# Altium schematic sheet 1_CORE.schdoc.schdoc
size 431 x 309 mm; Symbol: Sheet-Symbol_A3; Device: Sheet-Symbol_A3; Company: 嘉立创EDA; Version: V1.0; Page Size: A3; @Project Name: V3S_LCD; @Page Count: 4; @Update Date: 2023-12-17; @Create Date: 2023-12-14; @Schematic Name: Schematic1; @Page No: 1; @Page Name: CORE
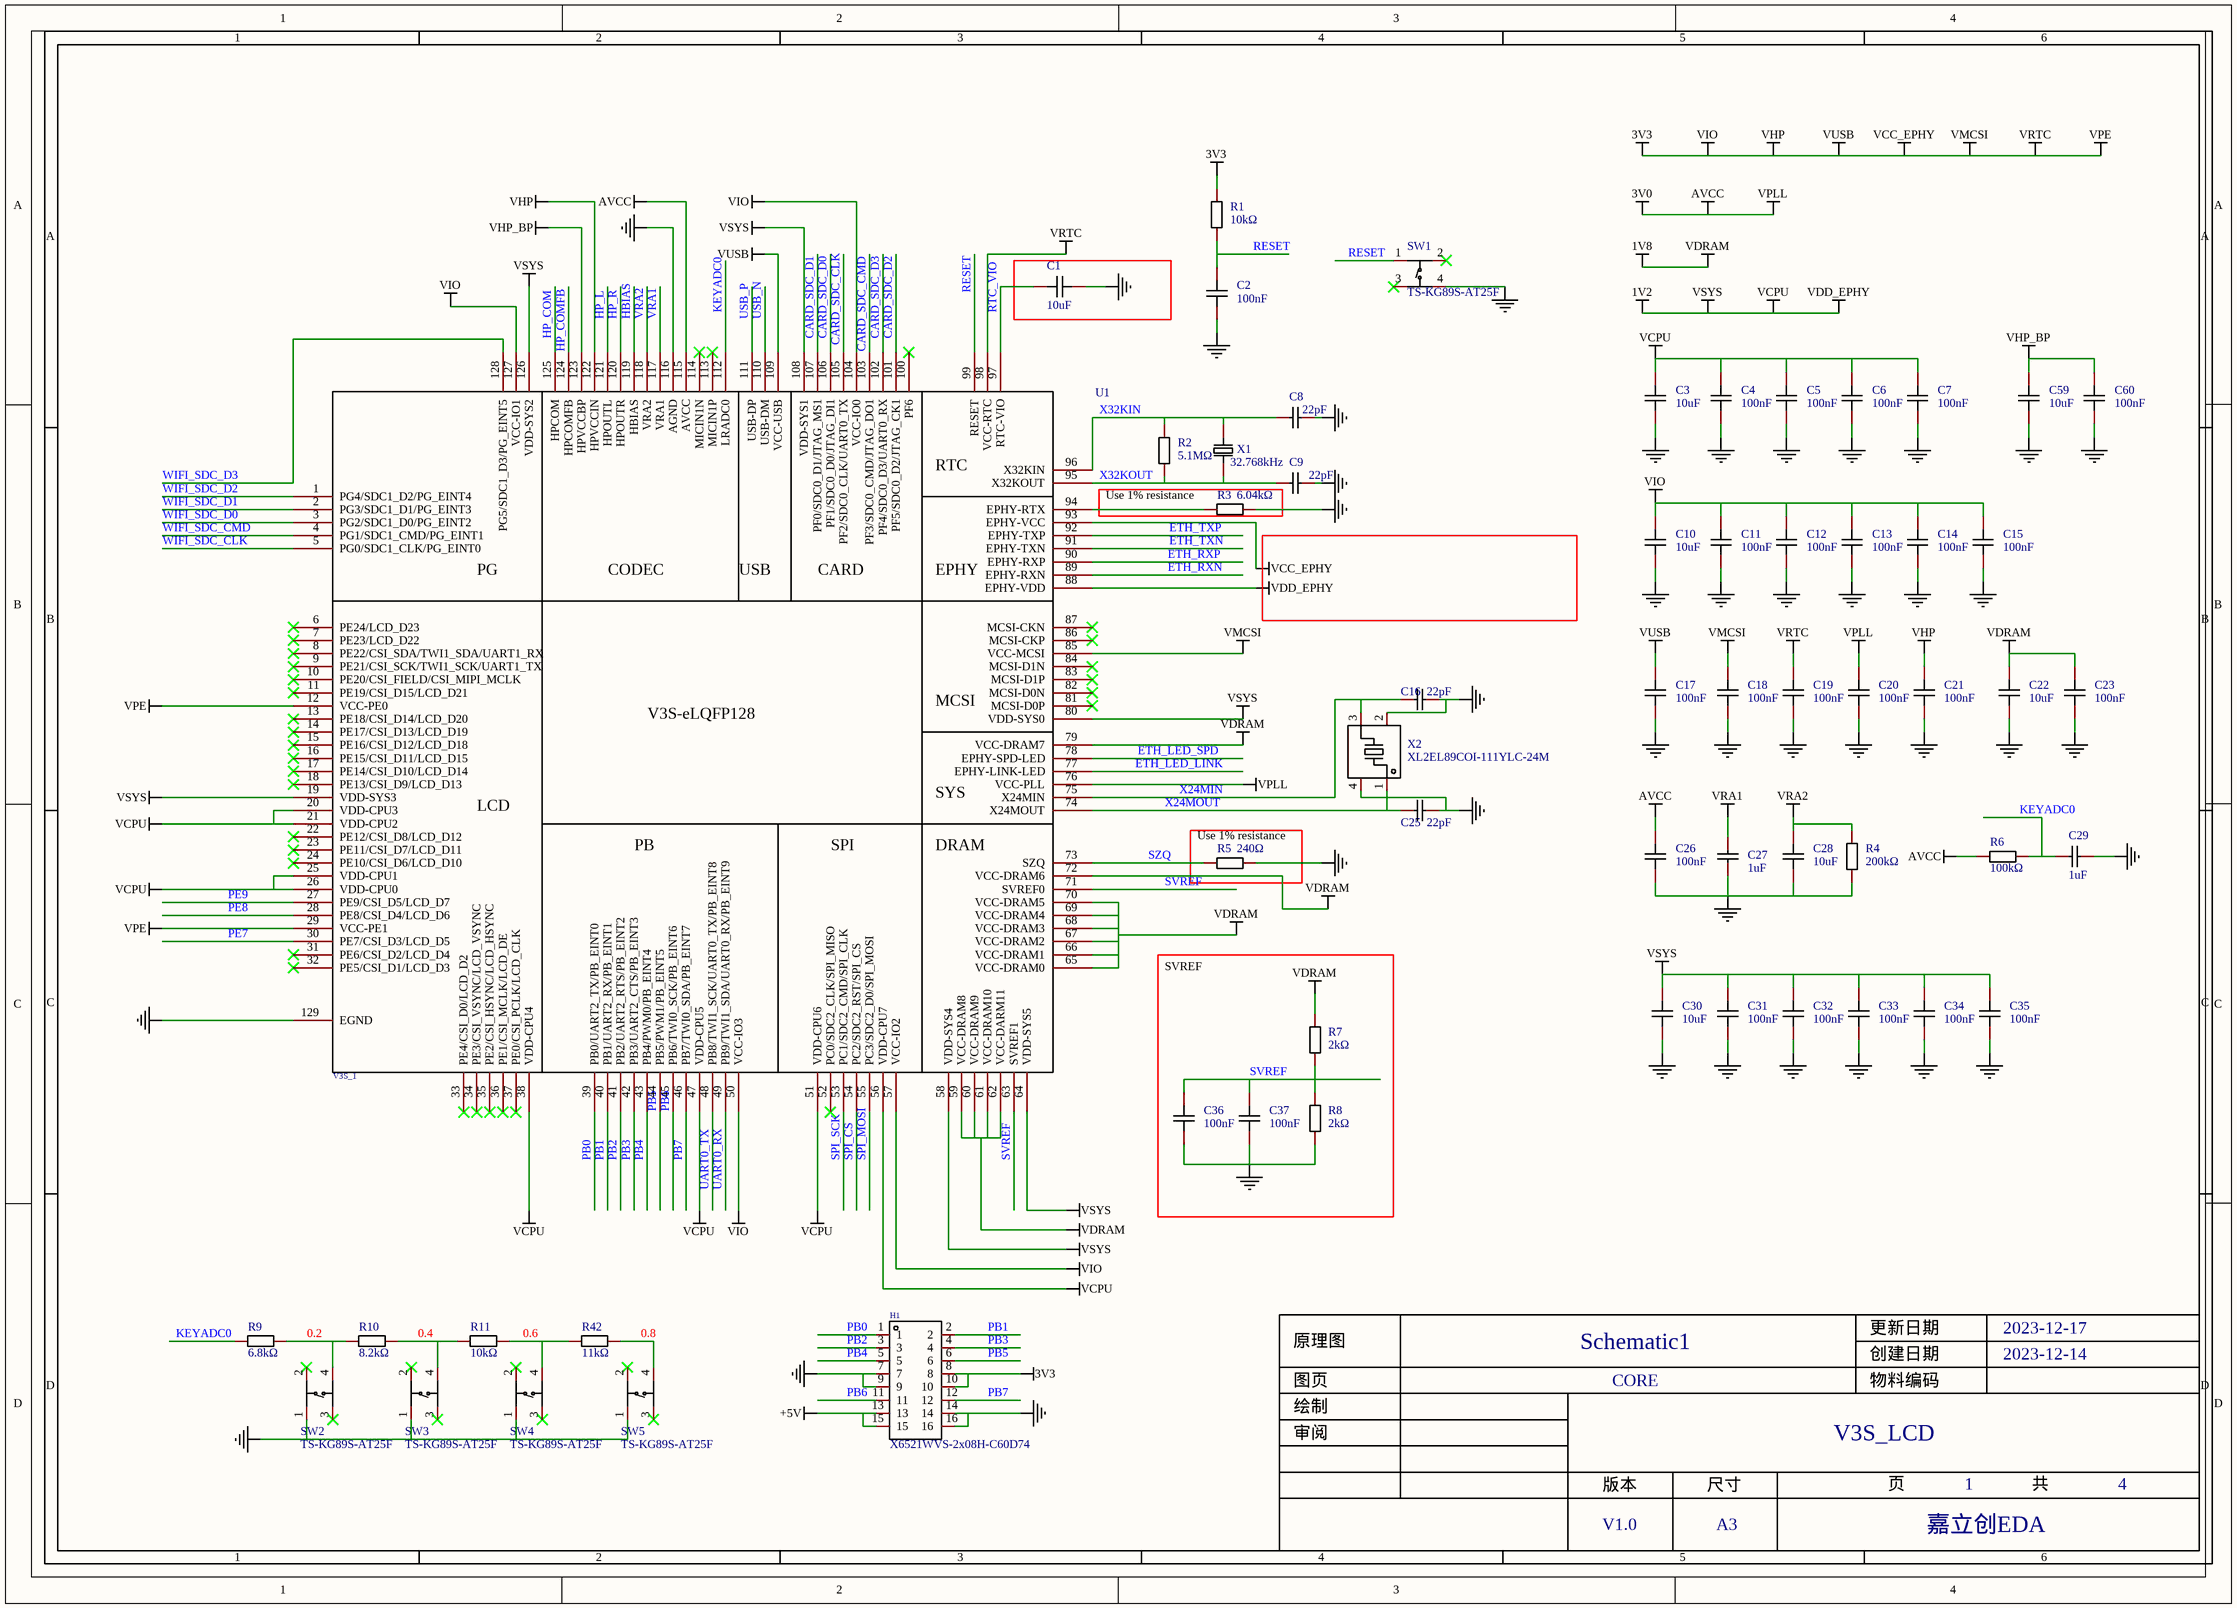
[diagram p0: 1_CORE.schdoc.schdoc]

## Parts
C1  10uF  [C0603]
C2  100nF  [C0603]
C3  10uF  [C0603]
C4  100nF  [C0603]
C5  100nF  [C0603]
C6  100nF  [C0603]
C7  100nF  [C0603]
C8  22pF  [C0603]
C9  22pF  [C0603]
C10  10uF  [C0603]
C11  100nF  [C0603]
C12  100nF  [C0603]
C13  100nF  [C0603]
C14  100nF  [C0603]
C15  100nF  [C0603]
C16  22pF  [C0603]
C17  100nF  [C0603]
C18  100nF  [C0603]
C19  100nF  [C0603]
C20  100nF  [C0603]
C21  100nF  [C0603]
C22  10uF  [C0603]
C23  100nF  [C0603]
C25  22pF  [C0603]
C26  100nF  [C0603]
C27  1uF  [C0603]
C28  10uF  [C0603]
C29  1uF  [C0603]
C30  10uF  [C0603]
C31  100nF  [C0603]
C32  100nF  [C0603]
C33  100nF  [C0603]
C34  100nF  [C0603]
C35  100nF  [C0603]
C36  100nF  [C0603]
C37  100nF  [C0603]
C59  10uF  [C0603]
C60  100nF  [C0603]
H1  X6521WVS-2x08H-C60D74  [HDR-SMD_16P-P2.54-V-M-R2-C8-S7.4]
R1  10kΩ  [R0603]
R2  5.1MΩ  [R0603]
R3  6.04kΩ  [R0603]
R4  200kΩ  [R0603]
R5  240Ω  [R0603]
R6  100kΩ  [R0603]
R7  2kΩ  [R0603]
R8  2kΩ  [R0603]
R9  6.8kΩ  [R0603]
R10  8.2kΩ  [R0603]
R11  10kΩ  [R0603]
R42  11kΩ  [R0603]
SW1  TS-KG89S-AT25F  [SW-SMD_4P-L4.2-W3.3-P2.15-LS5.1]
SW2  TS-KG89S-AT25F  [SW-SMD_4P-L4.2-W3.3-P2.15-LS5.1]
SW3  TS-KG89S-AT25F  [SW-SMD_4P-L4.2-W3.3-P2.15-LS5.1]
SW4  TS-KG89S-AT25F  [SW-SMD_4P-L4.2-W3.3-P2.15-LS5.1]
SW5  TS-KG89S-AT25F  [SW-SMD_4P-L4.2-W3.3-P2.15-LS5.1]
U1  V3S_1  [LQFP129 14x14_N]
X1  32.768kHz  [FC-135R_L3.2-W1.5]
X2  XL2EL89COI-111YLC-24M  [CRYSTAL-SMD_4P-L3.2-W2.5-BL]

## Blocks framed on the sheet
Use 1% resistance: R3
Use 1% resistance: R5
SVREF: C36 C37 R7 R8

## Nets
1V2: C3.2 C4.2 C5.2 C6.2 C7.2 C30.2 C31.2 C32.2 C33.2 C34.2 C35.2 U1.19(VDD-SYS3) U1.20(VDD-CPU3) U1.21(VDD-CPU2) U1.25(VDD-CPU1) U1.26(VDD-CPU0) U1.38(VDD-CPU4) U1.47(VDD-CPU5) U1.51(VDD-CPU6) U1.56(VDD-CPU7) U1.58(VDD-SYS4) U1.64(VDD-SYS5) U1.80(VDD-SYS0) U1.88(EPHY-VDD) U1.108(VDD-SYS1) U1.126(VDD-SYS2)  [also labelled VCPU, VDD_EPHY, VSYS]
1V8: C22.2 C23.2 R7.2 U1.59(VCC-DRAM8) U1.60(VCC-DRAM9) U1.61(VCC-DRAM10) U1.62(VCC-DARM11) U1.65(VCC-DRAM0) U1.66(VCC-DRAM1) U1.67(VCC-DRAM2) U1.68(VCC-DRAM3) U1.69(VCC-DRAM4) U1.70(VCC-DRAM5) U1.72(VCC-DRAM6) U1.79(VCC-DRAM7)  [also labelled VDRAM]
3V0: C20.2 C26.2 R6.1 U1.76(VCC-PLL) U1.115(AVCC)  [also labelled AVCC, VPLL]
3V3: C10.2 C11.2 C12.2 C13.2 C14.2 C15.2 C17.2 C18.2 C19.2 C21.2 H1.8 H1.10 R1.2 U1.12(VCC-PE0) U1.29(VCC-PE1) U1.50(VCC-IO3) U1.57(VCC-IO2) U1.85(VCC-MCSI) U1.93(EPHY-VCC) U1.98(VCC-RTC) U1.104(VCC-IO0) U1.109(VCC-USB) U1.122(HPVCCIN) U1.127(VCC-IO1)  [also labelled VCC_EPHY, VHP, VIO, VMCSI, VPE, VRTC, VUSB]
+5V: H1.13 H1.15
NetC1_2: C1.2 C2.1 C3.1 C4.1 C5.1 C6.1 C7.1 C8.1 C9.1 C10.1 C11.1 C12.1 C13.1 C14.1 C15.1 C16.2 C17.1 C18.1 C19.1 C20.1 C21.1 C22.1 C23.1 C25.2 C26.1 C27.1 C28.1 C29.2 C30.1 C31.1 C32.1 C33.1 C34.1 C35.1 C36.1 C37.1 C59.1 C60.1 H1.7 H1.9 H1.14 H1.16 R3.2 R4.1 R5.2 R8.1 SW1.4 SW2.1 SW3.1 SW4.1 SW5.1 U1.116(AGND) U1.129(EGND) X2.2(GND) X2.4(GND)
VHP_BP: C59.2 C60.2 U1.123(HPVCCBP)
VRA1: C27.2 U1.117(VRA1)
VRA2: C28.2 R4.2 U1.118(VRA2)
CARD_SDC_CLK: U1.105(PF2/SDC0_CLK/UART0_TX)
CARD_SDC_CMD: U1.103(PF3/SDC0_CMD/JTAG_DO1)
CARD_SDC_D0: U1.106(PF1/SDC0_D0/JTAG_DI1)
CARD_SDC_D1: U1.107(PF0/SDC0_D1/JTAG_MS1)
CARD_SDC_D2: U1.101(PF5/SDC0_D2/JTAG_CK1)
CARD_SDC_D3: U1.102(PF4/SDC0_D3/UART0_RX)
ETH_LED_LINK: U1.77(EPHY-LINK-LED)
ETH_LED_SPD: U1.78(EPHY-SPD-LED)
ETH_RXN: U1.89(EPHY-RXN)
ETH_RXP: U1.90(EPHY-RXP)
ETH_TXN: U1.91(EPHY-TXN)
ETH_TXP: U1.92(EPHY-TXP)
HBIAS: U1.119(HBIAS)
HP_COM: U1.125(HPCOM)
HP_COMFB: U1.124(HPCOMFB)
HP_L: U1.121(HPOUTL)
HP_R: U1.120(HPOUTR)
KEYADC0: C29.1 R6.2 R9.1 U1.112(LRADC0)
PB0: H1.1 U1.39(PB0/UART2_TX/PB_EINT0)
PB1: H1.2 U1.40(PB1/UART2_RX/PB_EINT1)
PB2: H1.3 U1.41(PB2/UART2_RTS/PB_EINT2)
PB3: H1.4 U1.42(PB3/UART2_CTS/PB_EINT3)
PB4: H1.5 U1.43(PB4/PWM0/PB_EINT4)
PB5: H1.6 U1.44(PB5/PWM1/PB_EINT5)
PB6: H1.11 U1.45(PB6/TWI0_SCK/PB_EINT6)
PB7: H1.12 U1.46(PB7/TWI0_SDA/PB_EINT7)
PE7: U1.30(PE7/CSI_D3/LCD_D5)
PE8: U1.28(PE8/CSI_D4/LCD_D6)
PE9: U1.27(PE9/CSI_D5/LCD_D7)
RESET: C2.2 R1.1 SW1.1 U1.99(RESET)
RTC_VIO: C1.1 U1.97(RTC-VIO)
SPI_CS: U1.54(PC2/SDC2_RST/SPI_CS)
SPI_MOSI: U1.55(PC3/SDC2_D0/SPI_MOSI)
SPI_SCK: U1.53(PC1/SDC2_CMD/SPI_CLK)
SVREF: C36.2 C37.2 R7.1 R8.2 U1.63(SVREF1) U1.71(SVREF0)
SZQ: R5.1 U1.73(SZQ)
UART0_RX: U1.49(PB9/TWI1_SDA/UART0_RX/PB_EINT9)
UART0_TX: U1.48(PB8/TWI1_SCK/UART0_TX/PB_EINT8)
USB_N: U1.110(USB-DM)
USB_P: U1.111(USB-DP)
WIFI_SDC_CLK: U1.5(PG0/SDC1_CLK/PG_EINT0)
WIFI_SDC_CMD: U1.4(PG1/SDC1_CMD/PG_EINT1)
WIFI_SDC_D0: U1.3(PG2/SDC1_D0/PG_EINT2)
WIFI_SDC_D1: U1.2(PG3/SDC1_D1/PG_EINT3)
WIFI_SDC_D2: U1.1(PG4/SDC1_D2/PG_EINT4)
WIFI_SDC_D3: U1.128(PG5/SDC1_D3/PG_EINT5)
X24MIN: C16.1 U1.75(X24MIN) X2.3
X24MOUT: C25.1 U1.74(X24MOUT) X2.1
X32KIN: C8.2 R2.2 U1.96(X32KIN) X1.2
X32KOUT: C9.2 R2.1 U1.95(X32KOUT) X1.1
NetR3_1: R3.1 U1.94(EPHY-RTX)
NetR9_2: R9.2 R10.1 SW2.4
NetR10_2: R10.2 R11.1 SW3.4
NetR11_2: R11.2 R42.1 SW4.4
NetR42_2: R42.2 SW5.4

Not connected (* = marked no-connect by the designer): SW1 2* 3*; SW2 2* 3*; SW3 2* 3*; SW4 2* 3*; SW5 2* 3*; U1 6(PE24/LCD_D23)* 7(PE23/LCD_D22)* 8(PE22/CSI_SDA/TWI1_SDA/UART1_RX)* 9(PE21/CSI_SCK/TWI1_SCK/UART1_TX)* 10(PE20/CSI_FIELD/CSI_MIPI_MCLK)* 11(PE19/CSI_D15/LCD_D21)* 13(PE18/CSI_D14/LCD_D20)* 14(PE17/CSI_D13/LCD_D19)* 15(PE16/CSI_D12/LCD_D18)* 16(PE15/CSI_D11/LCD_D15)* 17(PE14/CSI_D10/LCD_D14)* 18(PE13/CSI_D9/LCD_D13)* 22(PE12/CSI_D8/LCD_D12)* 23(PE11/CSI_D7/LCD_D11)* 24(PE10/CSI_D6/LCD_D10)* 31(PE6/CSI_D2/LCD_D4)* 32(PE5/CSI_D1/LCD_D3)* 33(PE4/CSI_D0/LCD_D2)* 34(PE3/CSI_VSYNC/LCD_VSYNC)* 35(PE2/CSI_HSYNC/LCD_HSYNC)* 36(PE1/CSI_MCLK/LCD_DE)* 37(PE0/CSI_PCLK/LCD_CLK)* 52(PC0/SDC2_CLK/SPI_MISO)* 81(MCSI-D0P)* 82(MCSI-D0N)* 83(MCSI-D1P)* 84(MCSI-D1N)* 86(MCSI-CKP)* 87(MCSI-CKN)* 100(PF6)* 113(MICIN1P)* 114(MICIN1N)*

## Notes on the sheet
- 0.2
- 0.4
- 0.6
- 0.8
- 1
- 2
- 3
- 4
- 5
- 6
- A
- B
- C
- 原理图
- Schematic1
- 创建日期
- 更新日期
- 2023-12-17
- 2023-12-14
- D
- 审阅
- 绘制
- 图页
- CORE
- 物料编码
- V3S_LCD
- 版本
- 尺寸
- 页
- 共
- V1.0
- A3
- 嘉立创EDA
- (in symbol LQFP129 14x14_N) RTC; PG; CODEC; USB; CARD; EPHY; MCSI; V3S-eLQFP128; SYS; LCD; PB; SPI; DRAM

## Library data of the parts
C1 C3 C10 C22 C28 C30 C59 = CL10A106KP8NNNC: Manufacturer: SAMSUNG(三星); Add into BOM: yes; Tolerance: ±10%; Voltage Rated: 10V; Temperature Coefficient: X5R; Description: 容值:10uF;精度:±10%;额定电压:10V;材质(温度系数):X5R;; Name: 10uF; Symbol: CL10A106KP8NNNC; Device: CL10A106KP8NNNC; Supplier: LCSC; Manufacturer Part: CL10A106KP8NNNC; Value: 10uF; Supplier Part: C19702; JLCPCB Part Class: 基础库; LCSC Part Name: 10uF ±10% 10V; Supplier Footprint: 0603; Datasheet: https://atta.szlcsc.com/upload/public/pdf/source/20160218/1457707763339.pdf; Convert to PCB: yes
C2 C4-C7 C11-C15 C17-C21 C23 C26 C31-C37 C60 = CC0603KRX7R9BB104: Manufacturer: YAGEO(国巨); Add into BOM: yes; Tolerance: ±10%; Voltage Rated: 50V; Temperature Coefficient: X7R; Description: 容值:100nF;精度:±10%;额定电压:50V;材质(温度系数):X7R;; Name: 100nF; Symbol: CC0603KRX7R9BB104; Device: CC0603KRX7R9BB104; Supplier: LCSC; Manufacturer Part: CC0603KRX7R9BB104; Value: 100nF; Supplier Part: C14663; JLCPCB Part Class: Basic Part; LCSC Part Name: 100nF ±10% 50V; Supplier Footprint: 0603; Datasheet: https://atta.szlcsc.com/upload/public/pdf/source/20180910/C282072_33301C7F631E79921B82A8DAC6BCC5B3.pdf; Convert to PCB: yes
C8 C9 C16 C25 = CL10C220JB8NNNC: Manufacturer: SAMSUNG(三星); Add into BOM: yes; Tolerance: ±5%; Voltage Rated: 50V; Temperature Coefficient: C0G; Description: 容值:22pF;精度:±5%;额定电压:50V;材质(温度系数):C0G;; Name: 22pF; Symbol: CL10C220JB8NNNC; Device: CL10C220JB8NNNC; Supplier: LCSC; Manufacturer Part: CL10C220JB8NNNC; Value: 22pF; Supplier Part: C1653; LCSC Part Name: 22pF ±5% 50V; Supplier Footprint: 0603; Datasheet: https://atta.szlcsc.com/upload/public/pdf/source/20160218/1457707763339.pdf; Convert to PCB: yes
  C8 C9: JLCPCB Part Class: 基础库
  C16 C25: JLCPCB Part Class: Basic Part
C27 C29 = CL10A105KB8NNNC: Manufacturer: SAMSUNG(三星); Add into BOM: yes; Tolerance: ±10%; Voltage Rated: 50V; Temperature Coefficient: X5R; Description: 容值:1uF;精度:±10%;额定电压:50V;材质(温度系数):X5R;; Name: 1uF; Symbol: CL10A105KB8NNNC; Device: CL10A105KB8NNNC; Supplier: LCSC; Manufacturer Part: CL10A105KB8NNNC; Value: 1uF; Supplier Part: C15849; JLCPCB Part Class: Basic Part; LCSC Part Name: 1uF ±10% 50V; Supplier Footprint: 0603; Datasheet: https://atta.szlcsc.com/upload/public/pdf/source/20160218/1457707763339.pdf; Convert to PCB: yes
H1 = X6521WVS-2x08H-C60D74: Manufacturer: XKB Connectivity(中国星坤); Add into BOM: yes; Pitch: 2.54mm; Pin Structure: 2x8P; Circluar Pins/Square Pins: 方针; Current Rating (Max): 3A; Voltage Rating (Max): 250V; Welding Temperature (Max): 260℃; Description: 间距:2.54mm;总PIN位数:16;排数:2;插针结构:2x8P;行距:-;安装类型:立贴;圆针/方针:方针;额定电流:3A;额定电压:250V;配合针长度:6mm;塑高:2.5mm;端接针长度:-;触头材质:黄铜;触头镀层:金;工作温度范围:-40℃~+105℃;焊接温度(最大值):260℃;; Name: X6521WVS-2x08H-C60D74; Symbol: X6521WVS-2X08H-C60D74; Device: X6521WVS-2x08H-C60D74; Supplier: LCSC; Supplier Part: C2884017; Manufacturer Part: X6521WVS-2x08H-C60D74; link: https://atta.szlcsc.com/upload/public/pdf/source/20211009/E3239EE5247E6BAFECB8B74A4FCF9AB8.pdf; JLCPCB Part Class: 扩展库; LCSC Part Name: 2.54mm 2x8P; Supplier Footprint: SMD,P=2.54mm; Convert to PCB: yes; Number of Pins: 16; Number of Rows: 2; Row Spacing: -; Mounting Type: 立贴; Length of Mating Pin: 6mm; Insulation Height: 2.5mm; Length of End Connection Pin: -; Contact Material: 黄铜; Contact Plating: 金; Operating Temperature Range: -40℃~+105℃
R1 R11 = 0603WAF1002T5E: Manufacturer: UNI-ROYAL(厚声); Add into BOM: yes; Tolerance: ±1%; Power(Watts): 100mW; Overload Voltage (Max): 75V; Temperature Coefficient: ±100ppm/℃; Description: 阻值:10kΩ;精度:±1%;功率:100mW;温度系数:±100ppm/℃;电阻类型:厚膜电阻;; Name: 10kΩ; Symbol: 0603WAF1002T5E; Device: 0603WAF1002T5E; Supplier: LCSC; Manufacturer Part: 0603WAF1002T5E; Supplier Part: C25804; Value: 10kΩ; JLCPCB Part Class: Basic Part; LCSC Part Name: 10kΩ ±1% 100mW 厚膜电阻; Supplier Footprint: 0603; Datasheet: https://atta.szlcsc.com/upload/public/pdf/source/20200306/C422600_1E6D84923E4A46A82E41ADD87F860B5C.pdf; Convert to PCB: yes; Type: 厚膜电阻; Operating Temperature Range: -55℃~+155℃
R2 = 0603WAF5104T5E: Manufacturer: UNI-ROYAL(厚声); Add into BOM: yes; Tolerance: ±1%; Power(Watts): 100mW; Overload Voltage (Max): 75V; Temperature Coefficient: ±100ppm/℃; Description: 阻值:5.1MΩ;精度:±1%;功率:100mW;温度系数:±100ppm/℃;电阻类型:厚膜电阻;; Name: 5.1MΩ; Symbol: 0603WAF5104T5E; Device: 0603WAF5104T5E; Supplier: LCSC; Manufacturer Part: 0603WAF5104T5E; Supplier Part: C13320; Value: 5.1MΩ; JLCPCB Part Class: 扩展库; LCSC Part Name: 5.1MΩ ±1% 100mW 厚膜电阻; Supplier Footprint: 0603; Datasheet: https://atta.szlcsc.com/upload/public/pdf/source/20200306/C422600_1E6D84923E4A46A82E41ADD87F860B5C.pdf; Convert to PCB: yes; Type: 厚膜电阻; Operating Temperature Range: -55℃~+155℃
R3 = RS-03K6041FT: Manufacturer: FH(风华); Add into BOM: yes; Tolerance: ±1%; Temperature Coefficient: ±100ppm/℃; Power(Watts): 100mW; Overload Voltage (Max): 50V; Description: 精度:±1%;阻值:6.04kΩ;温度系数:±100ppm/℃;功率:100mW;最大工作电压:50V;工作温度范围:-55℃~+155℃;; Name: 6.04kΩ; Symbol: RS-03K6041FT; Device: RS-03K6041FT; LCSC Part Name: 6.04KΩ(6041) ±1%; Supplier Part: C321958; Manufacturer Part: RS-03K6041FT; Supplier Footprint: 0603; JLCPCB Part Class: 扩展库; Datasheet: https://atta.szlcsc.com/upload/public/pdf/source/20181120/C321958_6C2F38EC8FC6EE9B682ADC77C67844ED.pdf; Supplier: LCSC; Convert to PCB: yes; Value: 6.04kΩ; Operating Temperature Range: -55℃~+155℃
R4 = 0603WAF2003T5E: Manufacturer: UNI-ROYAL(厚声); Add into BOM: yes; Tolerance: ±1%; Power(Watts): 100mW; Overload Voltage (Max): 75V; Temperature Coefficient: ±100ppm/℃; Description: 阻值:200kΩ;精度:±1%;功率:100mW;温度系数:±100ppm/℃;电阻类型:厚膜电阻;; Name: 200kΩ; Symbol: 0603WAF2003T5E; Device: 0603WAF2003T5E; Supplier: LCSC; Manufacturer Part: 0603WAF2003T5E; Supplier Part: C25811; Value: 200kΩ; JLCPCB Part Class: 基础库; LCSC Part Name: 200kΩ ±1% 100mW 厚膜电阻; Supplier Footprint: 0603; Datasheet: https://atta.szlcsc.com/upload/public/pdf/source/20200306/C422600_1E6D84923E4A46A82E41ADD87F860B5C.pdf; Convert to PCB: yes; Type: 厚膜电阻; Operating Temperature Range: -55℃~+155℃
R5 = 0603WAF2400T5E: Manufacturer: UNI-ROYAL(厚声); Add into BOM: yes; Tolerance: ±1%; Power(Watts): 100mW; Overload Voltage (Max): 75V; Temperature Coefficient: ±100ppm/℃; Description: 阻值:240Ω;精度:±1%;功率:100mW;温度系数:±100ppm/℃;电阻类型:厚膜电阻;; Name: 240Ω; Symbol: 0603WAF2400T5E; Device: 0603WAF2400T5E; Supplier: LCSC; Manufacturer Part: 0603WAF2400T5E; Supplier Part: C23350; Value: 240Ω; JLCPCB Part Class: 扩展库; LCSC Part Name: 240Ω ±1% 100mW 厚膜电阻; Supplier Footprint: 0603; Datasheet: https://atta.szlcsc.com/upload/public/pdf/source/20200306/C422600_1E6D84923E4A46A82E41ADD87F860B5C.pdf; Convert to PCB: yes; Type: 厚膜电阻; Operating Temperature Range: -55℃~+155℃
R6 = 0603WAF1003T5E: Manufacturer: UNI-ROYAL(厚声); Add into BOM: yes; Tolerance: ±1%; Power(Watts): 100mW; Overload Voltage (Max): 75V; Temperature Coefficient: ±100ppm/℃; Description: 阻值:100kΩ;精度:±1%;功率:100mW;温度系数:±100ppm/℃;电阻类型:厚膜电阻;; Name: 100kΩ; Symbol: 0603WAF1003T5E; Device: 0603WAF1003T5E; Supplier: LCSC; Manufacturer Part: 0603WAF1003T5E; Supplier Part: C25803; Value: 100kΩ; JLCPCB Part Class: Basic Part; LCSC Part Name: 100kΩ ±1% 100mW 厚膜电阻; Supplier Footprint: 0603; Datasheet: https://atta.szlcsc.com/upload/public/pdf/source/20200306/C422600_1E6D84923E4A46A82E41ADD87F860B5C.pdf; Convert to PCB: yes; Type: 厚膜电阻; Operating Temperature Range: -55℃~+155℃
R7 R8 = 0603WAF2001T5E: Manufacturer: UNI-ROYAL(厚声); Add into BOM: yes; Tolerance: ±1%; Power(Watts): 100mW; Overload Voltage (Max): 75V; Temperature Coefficient: ±100ppm/℃; Description: 阻值:2kΩ;精度:±1%;功率:100mW;温度系数:±100ppm/℃;电阻类型:厚膜电阻;; Name: 2kΩ; Symbol: 0603WAF2001T5E; Device: 0603WAF2001T5E; Supplier: LCSC; Manufacturer Part: 0603WAF2001T5E; Supplier Part: C22975; Value: 2kΩ; JLCPCB Part Class: Basic Part; LCSC Part Name: 2kΩ ±1% 100mW 厚膜电阻; Supplier Footprint: 0603; Datasheet: https://atta.szlcsc.com/upload/public/pdf/source/20200306/C422600_1E6D84923E4A46A82E41ADD87F860B5C.pdf; Convert to PCB: yes; Type: 厚膜电阻; Operating Temperature Range: -55℃~+155℃
R9 = 0603WAF6801T5E: Manufacturer: UNI-ROYAL(厚声); Add into BOM: yes; Tolerance: ±1%; Power(Watts): 100mW; Overload Voltage (Max): 75V; Temperature Coefficient: ±100ppm/℃; Description: 阻值:6.8kΩ;精度:±1%;功率:100mW;温度系数:±100ppm/℃;电阻类型:厚膜电阻;; Name: 6.8kΩ; Symbol: 0603WAF6801T5E; Device: 0603WAF6801T5E; Supplier: LCSC; Manufacturer Part: 0603WAF6801T5E; Supplier Part: C23212; Value: 6.8kΩ; JLCPCB Part Class: Basic Part; LCSC Part Name: 6.8kΩ ±1% 100mW 厚膜电阻; Supplier Footprint: 0603; Datasheet: https://atta.szlcsc.com/upload/public/pdf/source/20200306/C422600_1E6D84923E4A46A82E41ADD87F860B5C.pdf; Convert to PCB: yes; Type: 厚膜电阻; Operating Temperature Range: -55℃~+155℃
R10 = 0603WAF8201T5E: Manufacturer: UNI-ROYAL(厚声); Add into BOM: yes; Tolerance: ±1%; Power(Watts): 100mW; Overload Voltage (Max): 75V; Temperature Coefficient: ±100ppm/℃; Description: 阻值:8.2kΩ;精度:±1%;功率:100mW;温度系数:±100ppm/℃;电阻类型:厚膜电阻;; Name: 8.2kΩ; Symbol: 0603WAF8201T5E; Device: 0603WAF8201T5E; Supplier: LCSC; Manufacturer Part: 0603WAF8201T5E; Supplier Part: C25981; Value: 8.2kΩ; JLCPCB Part Class: Basic Part; LCSC Part Name: 8.2kΩ ±1% 100mW 厚膜电阻; Supplier Footprint: 0603; Datasheet: https://atta.szlcsc.com/upload/public/pdf/source/20200306/C422600_1E6D84923E4A46A82E41ADD87F860B5C.pdf; Convert to PCB: yes; Type: 厚膜电阻; Operating Temperature Range: -55℃~+155℃
R42 = 0603WAF1102T5E: Manufacturer: UNI-ROYAL(厚声); Add into BOM: yes; Tolerance: ±1%; Power(Watts): 100mW; Overload Voltage (Max): 75V; Temperature Coefficient: ±100ppm/℃; Description: 阻值:11kΩ;精度:±1%;功率:100mW;温度系数:±100ppm/℃;电阻类型:厚膜电阻;; Name: 11kΩ; Symbol: 0603WAF1102T5E; Device: 0603WAF1102T5E; Supplier: LCSC; Manufacturer Part: 0603WAF1102T5E; Supplier Part: C25950; Value: 11kΩ; JLCPCB Part Class: Basic Part; LCSC Part Name: 11kΩ ±1% 100mW 厚膜电阻; Supplier Footprint: 0603; Datasheet: https://atta.szlcsc.com/upload/public/pdf/source/20200306/C422600_1E6D84923E4A46A82E41ADD87F860B5C.pdf; Convert to PCB: yes; Type: 厚膜电阻; Operating Temperature Range: -55℃~+155℃
SW1-SW5 = TS-KG89S-AT25F: Manufacturer: HANBO(汉博); Add into BOM: yes; Contact Current: 50mA; Voltage Rating (DC): 12V; Insulation Resistance: 100MΩ; Circuit: 单刀单掷; Actuator Style: 椭圆形按钮; Actuator/Cap Color: 白色; Operating Force: 250gf@±50gf; Mechanical Life: 10万次; Pin Style: SMD接片; Switch Length: 4.2mm; Switch Width: 3.25mm; Switch Height: 2.5mm; Strike Gundam: 否; Description: 触点电流:50mA;额定电压(DC):12V;绝缘电阻:100MΩ;电路结构:单刀单掷;安装方式:立贴;作用力:250gf@±50gf;机械寿命:10万次;带支架:否;; Name: TS-KG89S-AT25F; Symbol: TS-KG89S-AT25F; Device: TS-KG89S-AT25F; Supplier: LCSC; Supplier Part: C2874599; Manufacturer Part: TS-KG89S-AT25F; JLCPCB Part Class: 扩展库; LCSC Part Name: 4.2*3.25*2.5mm 立贴 轻触开关; Supplier Footprint: SMD; Datasheet: https://atta.szlcsc.com/upload/public/pdf/source/20221110/0D75E68DCC1CEC2670E8A2B9A9134A65.pdf; Convert to PCB: yes; Mounting Style: 立贴
U1 = LQFP129 14x14_N: Add into BOM: yes; Name: V3S_1; Symbol: V3S_1; Device: LQFP129 14x14_N; Convert to PCB: yes; Origin Footprint: LQFP129 14x14_N
X1 = Q13FC1350000400: Manufacturer: EPSON(爱普生); Add into BOM: yes; Crystal Type: 贴片无源晶振; Load Capacitance: 12.5pF; Equivalent Series Resistance (ESR): 70kΩ; Frequency Tolerance: ±20ppm; Description: 频率:32.768kHz;负载电容:12.5pF;频率公差:±20ppm;; Name: 32.768kHz; Symbol: Q13FC1350000400; Device: Q13FC1350000400; Supplier: LCSC; Manufacturer Part: Q13FC1350000400; Value: 32.768kHz; Supplier Part: C32346; JLCPCB Part Class: 基础库; LCSC Part Name: 32.768kHz ±20ppm 12.5pF; Supplier Footprint: SMD3215-2P; Datasheet: https://atta.szlcsc.com/upload/public/pdf/source/20190108/C32346_746D6B07EAF90824457A96480007685F.pdf; Convert to PCB: yes; Operating Temperature: -40℃~+85℃
X2 = XL2EL89COI-111YLC-24M: Manufacturer: YXC(扬兴晶振); Add into BOM: yes; Description: 频率： 24MHZ 负载： 12PF 频率公差： ±10PPM 工作温度： -40~85℃; Name: XL2EL89COI-111YLC-24M; Symbol: XL2EL89COI-111YLC-24M; Device: XL2EL89COI-111YLC-24M; Supplier: LCSC; Supplier Part: C5444545; Manufacturer Part: XL2EL89COI-111YLC-24M; JLCPCB Part Class: Extended Part; LCSC Part Name: 24MHZ 12PF ±10PPM YSX321SL; Supplier Footprint: SMD3225-4P; Datasheet: https://atta.szlcsc.com/upload/public/pdf/source/20230822/747CCFB439F2D13D53454752F2993171.pdf; Convert to PCB: yes